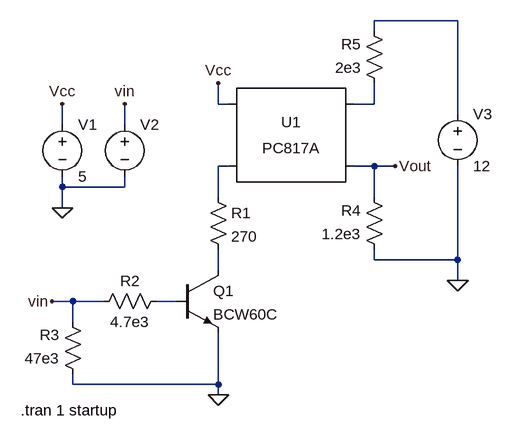
[diagram p0: schematic opto.asc]
opto.asc, the LTspice schematic file:
Version 4
SHEET 1 880 680
WIRE 400 -48 272 -48
WIRE 272 -32 272 -48
WIRE 32 80 32 48
WIRE 48 80 32 80
WIRE 272 80 272 48
WIRE 272 80 240 80
WIRE 400 96 400 -48
WIRE -208 112 -208 80
WIRE -112 112 -112 80
WIRE 48 176 32 176
WIRE 272 176 240 176
WIRE 304 176 272 176
WIRE -208 208 -208 192
WIRE -112 208 -112 192
WIRE -112 208 -208 208
WIRE 32 224 32 176
WIRE 272 224 272 176
WIRE -208 240 -208 208
WIRE 272 320 272 304
WIRE 400 320 400 176
WIRE 400 320 272 320
WIRE 32 336 32 304
WIRE 400 352 400 320
WIRE -192 384 -224 384
WIRE -144 384 -192 384
WIRE -32 384 -64 384
WIRE -192 416 -192 384
WIRE -192 512 -192 496
WIRE 32 512 32 432
WIRE 32 512 -192 512
WIRE 32 528 32 512
FLAG 32 528 0
FLAG 32 48 Vcc
FLAG -208 240 0
FLAG -208 80 Vcc
FLAG -112 80 vin
FLAG -224 384 vin
FLAG 304 176 Vout
FLAG 400 352 0
SYMBOL Optos\\PC817A 144 128 R0
SYMATTR InstName U1
SYMBOL res 16 208 R0
SYMATTR InstName R1
SYMATTR Value 270
SYMBOL npn -32 336 R0
SYMATTR InstName Q1
SYMATTR Value BCW60C
SYMBOL res -48 368 R90
WINDOW 0 0 56 VBottom 2
WINDOW 3 32 56 VTop 2
SYMATTR InstName R2
SYMATTR Value 4.7e3
SYMBOL res -176 512 R180
WINDOW 0 36 76 Left 2
WINDOW 3 36 40 Left 2
SYMATTR InstName R3
SYMATTR Value 47e3
SYMBOL res 288 320 R180
WINDOW 0 36 76 Left 2
WINDOW 3 36 40 Left 2
SYMATTR InstName R4
SYMATTR Value 1.2e3
SYMBOL voltage -208 96 R0
WINDOW 123 0 0 Left 0
WINDOW 39 0 0 Left 0
SYMATTR InstName V1
SYMATTR Value 5
SYMBOL voltage -112 96 R0
WINDOW 3 24 96 Invisible 2
WINDOW 123 0 0 Left 0
WINDOW 39 0 0 Left 0
SYMATTR Value PULSE(0 3.3 0 1e-6 1e-6 100e-3 200e-3)
SYMATTR InstName V2
SYMBOL voltage 400 80 R0
WINDOW 123 0 0 Left 0
WINDOW 39 0 0 Left 0
SYMATTR InstName V3
SYMATTR Value 12
SYMBOL res 288 64 R180
WINDOW 0 36 76 Left 2
WINDOW 3 36 40 Left 2
SYMATTR InstName R5
SYMATTR Value 2e3
TEXT -272 552 Left 2 !.tran 1 startup

The netlist it stands for:
* opto.asc
XU1 Vcc N003 N002 Vout PC817 Igain=1m
R1 N003 N004 270
Q1 N004 N005 0 0 BCW60C
R2 N005 vin 4.7e3
R3 0 vin 47e3
R4 0 Vout 1.2e3
V1 Vcc 0 5
V2 vin 0 PULSE(0 3.3 0 1e-6 1e-6 100e-3 200e-3)
V3 N001 0 12
R5 N002 N001 2e3
.model NPN NPN
.model PNP PNP
.lib standard.bjt
.tran 1 startup
.lib PC817.sub
.backanno
.end